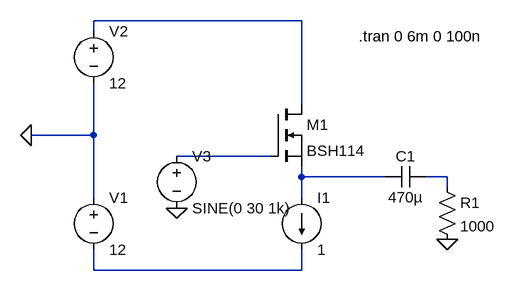
[diagram p0: schematic MOSFET clipping.asc]
MOSFET clipping.asc, the LTspice schematic file:
Version 4
SHEET 1 880 680
WIRE 576 96 256 96
WIRE 256 112 256 96
WIRE 576 224 576 96
WIRE 256 272 256 192
WIRE 256 272 160 272
WIRE 528 304 384 304
WIRE 576 336 576 320
WIRE 704 336 576 336
WIRE 800 336 768 336
WIRE 800 352 800 336
WIRE 256 368 256 272
WIRE 576 368 576 336
WIRE 256 480 256 448
WIRE 576 480 576 448
WIRE 576 480 256 480
FLAG 160 272 0
FLAG 800 432 0
FLAG 384 384 0
SYMBOL nmos 528 224 R0
SYMATTR InstName M1
SYMATTR Value BSH114
SYMBOL voltage 384 288 R0
SYMATTR InstName V3
SYMATTR Value SINE(0 30 1k)
SYMBOL voltage 256 352 R0
SYMATTR InstName V1
SYMATTR Value 12
SYMBOL voltage 256 96 R0
SYMATTR InstName V2
SYMATTR Value 12
SYMBOL current 576 368 R0
SYMATTR InstName I1
SYMATTR Value 1
SYMBOL cap 768 320 R90
WINDOW 0 0 32 VBottom 2
WINDOW 3 32 32 VTop 2
SYMATTR InstName C1
SYMATTR Value 470µ
SYMBOL res 784 336 R0
SYMATTR InstName R1
SYMATTR Value 1000
TEXT 664 120 Left 2 !.tran 0 6m 0 100n

The netlist it stands for:
* MOSFET clipping.asc
M1 N001 N002 N003 N003 BSH114
V3 N002 0 SINE(0 30 1k)
V1 0 N005 12
V2 N001 0 12
I1 N003 N005 1
C1 N004 N003 470µ
R1 N004 0 1000
.model NMOS NMOS
.model PMOS PMOS
.lib standard.mos
.tran 0 6m 0 100n
.backanno
.end